# EAGLE design processingController (EAGLE 6.4)
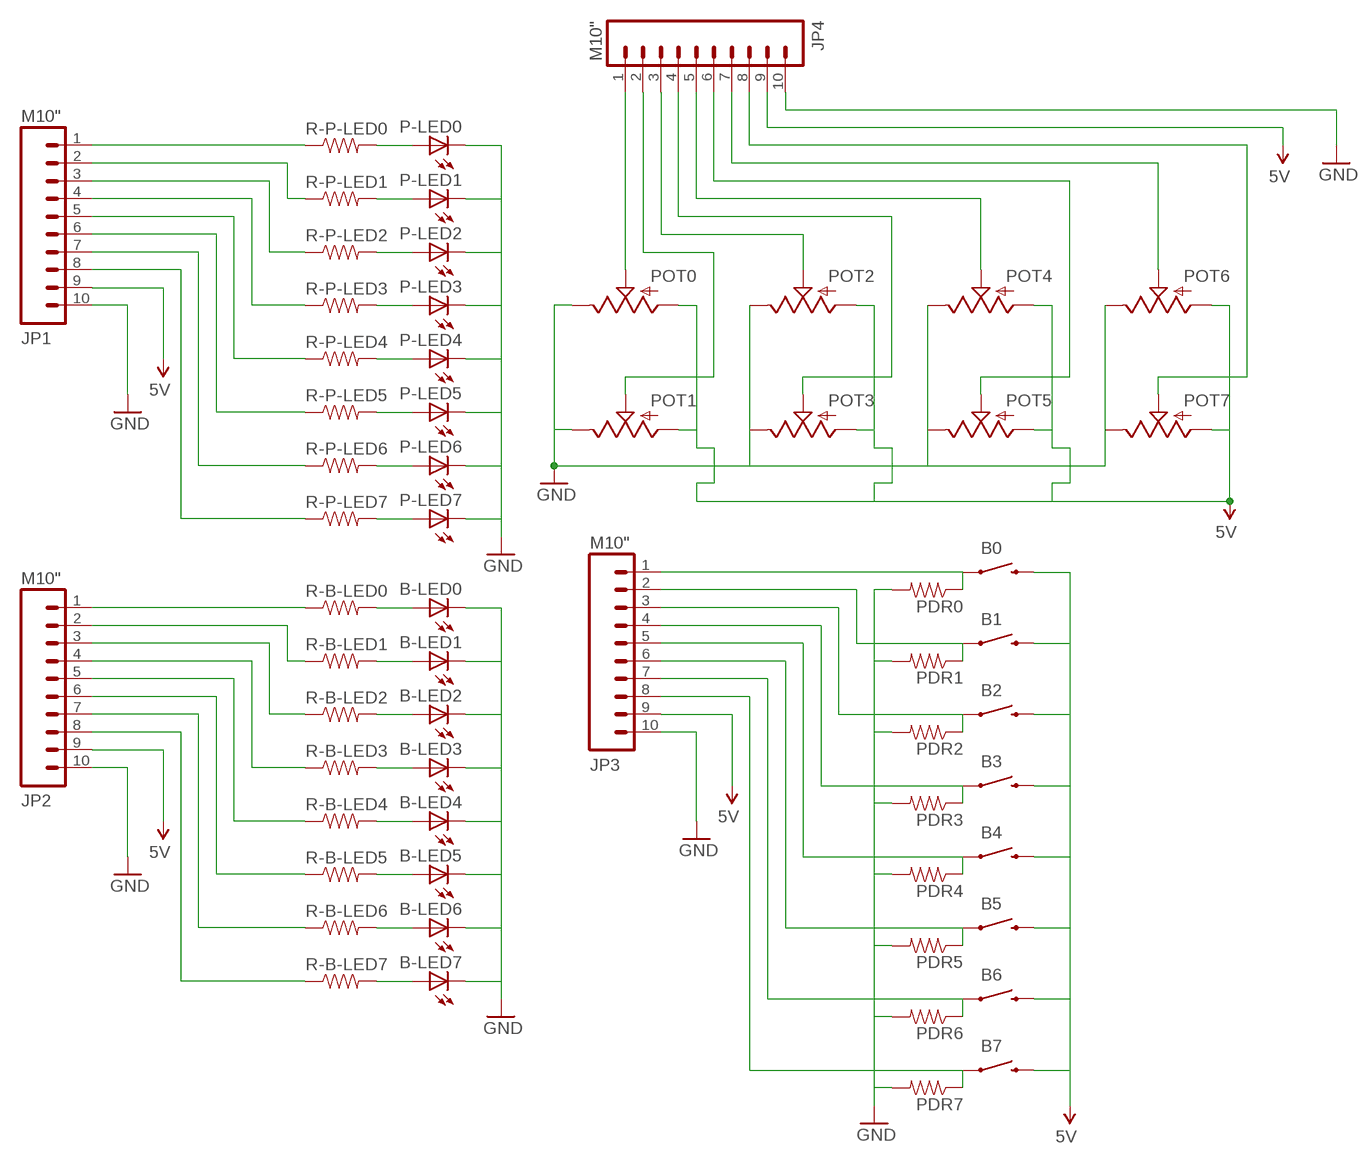
[diagram p0: schematic, sheet 1]

## Parts
B0  SWITCH-MOMENTARY-212MM  [TACTILE-PTH-12MM]
B1  SWITCH-MOMENTARY-212MM  [TACTILE-PTH-12MM]
B2  SWITCH-MOMENTARY-212MM  [TACTILE-PTH-12MM]
B3  SWITCH-MOMENTARY-212MM  [TACTILE-PTH-12MM]
B4  SWITCH-MOMENTARY-212MM  [TACTILE-PTH-12MM]
B5  SWITCH-MOMENTARY-212MM  [TACTILE-PTH-12MM]
B6  SWITCH-MOMENTARY-212MM  [TACTILE-PTH-12MM]
B7  SWITCH-MOMENTARY-212MM  [TACTILE-PTH-12MM]
B-LED0  LED3MM  [LED3MM]
B-LED1  LED3MM  [LED3MM]
B-LED2  LED3MM  [LED3MM]
B-LED3  LED3MM  [LED3MM]
B-LED4  LED3MM  [LED3MM]
B-LED5  LED3MM  [LED3MM]
B-LED6  LED3MM  [LED3MM]
B-LED7  LED3MM  [LED3MM]
JP1  M10"  [1X10]
JP2  M10"  [1X10]
JP3  M10"  [1X10]
JP4  M10"  [1X10]
P-LED0  LED3MM  [LED3MM]
P-LED1  LED3MM  [LED3MM]
P-LED2  LED3MM  [LED3MM]
P-LED3  LED3MM  [LED3MM]
P-LED4  LED3MM  [LED3MM]
P-LED5  LED3MM  [LED3MM]
P-LED6  LED3MM  [LED3MM]
P-LED7  LED3MM  [LED3MM]
PDR0  RESISTOREZ  [AXIAL-0.3EZ]
PDR1  RESISTOREZ  [AXIAL-0.3EZ]
PDR2  RESISTOREZ  [AXIAL-0.3EZ]
PDR3  RESISTOREZ  [AXIAL-0.3EZ]
PDR4  RESISTOREZ  [AXIAL-0.3EZ]
PDR5  RESISTOREZ  [AXIAL-0.3EZ]
PDR6  RESISTOREZ  [AXIAL-0.3EZ]
PDR7  RESISTOREZ  [AXIAL-0.3EZ]
POT0  POT  [ALPS_POT]
POT1  POT  [ALPS_POT]
POT2  POT  [ALPS_POT]
POT3  POT  [ALPS_POT]
POT4  POT  [ALPS_POT]
POT5  POT  [ALPS_POT]
POT6  POT  [ALPS_POT]
POT7  POT  [ALPS_POT]
R-B-LED0  RESISTOREZ  [AXIAL-0.3EZ]
R-B-LED1  RESISTOREZ  [AXIAL-0.3EZ]
R-B-LED2  RESISTOREZ  [AXIAL-0.3EZ]
R-B-LED3  RESISTOREZ  [AXIAL-0.3EZ]
R-B-LED4  RESISTOREZ  [AXIAL-0.3EZ]
R-B-LED5  RESISTOREZ  [AXIAL-0.3EZ]
R-B-LED6  RESISTOREZ  [AXIAL-0.3EZ]
R-B-LED7  RESISTOREZ  [AXIAL-0.3EZ]
R-P-LED0  RESISTOREZ  [AXIAL-0.3EZ]
R-P-LED1  RESISTOREZ  [AXIAL-0.3EZ]
R-P-LED2  RESISTOREZ  [AXIAL-0.3EZ]
R-P-LED3  RESISTOREZ  [AXIAL-0.3EZ]
R-P-LED4  RESISTOREZ  [AXIAL-0.3EZ]
R-P-LED5  RESISTOREZ  [AXIAL-0.3EZ]
R-P-LED6  RESISTOREZ  [AXIAL-0.3EZ]
R-P-LED7  RESISTOREZ  [AXIAL-0.3EZ]

## Nets
5V: B0.3 B1.3 B2.3 B3.3 B4.3 B5.3 B6.3 B7.3 JP1.9 JP2.9 JP3.9 JP4.9 POT0.P$3(A) POT1.P$3(A) POT2.P$3(A) POT3.P$3(A) POT4.P$3(A) POT5.P$3(A) POT6.P$3(A) POT7.P$3(A)
GND: B-LED0.K(C) B-LED1.K(C) B-LED2.K(C) B-LED3.K(C) B-LED4.K(C) B-LED5.K(C) B-LED6.K(C) B-LED7.K(C) JP1.10 JP2.10 JP3.10 JP4.10 P-LED0.K(C) P-LED1.K(C) P-LED2.K(C) P-LED3.K(C) P-LED4.K(C) P-LED5.K(C) P-LED6.K(C) P-LED7.K(C) PDR0.P$2 PDR1.P$2 PDR2.P$2 PDR3.P$2 PDR4.P$2 PDR5.P$2 PDR6.P$2 PDR7.P$2 POT0.P$1(E) POT1.P$1(E) POT2.P$1(E) POT3.P$1(E) POT4.P$1(E) POT5.P$1(E) POT6.P$1(E) POT7.P$1(E)
N$1: P-LED0.A R-P-LED0.P$2
N$2: P-LED1.A R-P-LED1.P$2
N$3: P-LED2.A R-P-LED2.P$2
N$4: P-LED3.A R-P-LED3.P$2
N$5: P-LED4.A R-P-LED4.P$2
N$6: P-LED5.A R-P-LED5.P$2
N$7: P-LED6.A R-P-LED6.P$2
N$8: P-LED7.A R-P-LED7.P$2
N$9: B-LED1.A R-B-LED1.P$2
N$10: B-LED2.A R-B-LED2.P$2
N$11: B-LED3.A R-B-LED3.P$2
N$12: B-LED4.A R-B-LED4.P$2
N$13: B-LED5.A R-B-LED5.P$2
N$14: B-LED6.A R-B-LED6.P$2
N$15: B-LED7.A R-B-LED7.P$2
N$16: B-LED0.A R-B-LED0.P$2
N$17: JP1.1 R-P-LED0.P$1
N$18: JP1.2 R-P-LED1.P$1
N$19: JP1.3 R-P-LED2.P$1
N$20: JP1.4 R-P-LED3.P$1
N$21: JP1.5 R-P-LED4.P$1
N$22: JP1.6 R-P-LED5.P$1
N$23: JP1.7 R-P-LED6.P$1
N$24: JP1.8 R-P-LED7.P$1
N$25: JP4.1 POT0.P$2(S)
N$26: JP2.1 R-B-LED0.P$1
N$27: JP2.2 R-B-LED1.P$1
N$28: JP2.3 R-B-LED2.P$1
N$29: JP2.4 R-B-LED3.P$1
N$30: JP2.5 R-B-LED4.P$1
N$31: JP2.6 R-B-LED5.P$1
N$32: JP2.7 R-B-LED6.P$1
N$33: JP2.8 R-B-LED7.P$1
N$34: JP4.3 POT2.P$2(S)
N$35: JP4.5 POT4.P$2(S)
N$36: JP4.7 POT6.P$2(S)
N$42: JP4.2 POT1.P$2(S)
N$44: JP4.4 POT3.P$2(S)
N$45: JP4.6 POT5.P$2(S)
N$46: JP4.8 POT7.P$2(S)
PDR0: B0.1 JP3.1 PDR0.P$1
PDR1: B1.1 JP3.2 PDR1.P$1
PDR2: B2.1 JP3.3 PDR2.P$1
PDR3: B3.1 JP3.4 PDR3.P$1
PDR4: B4.1 JP3.5 PDR4.P$1
PDR5: B5.1 JP3.6 PDR5.P$1
PDR6: B6.1 JP3.7 PDR6.P$1
PDR7: B7.1 JP3.8 PDR7.P$1

## Library data of the parts
B0 B1-B7 = SparkFun-Electromechanical:SWITCH-MOMENTARY-2: Various NO switches- pushbuttons, reed, etc
B-LED0 B-LED1-B-LED7 P-LED0 P-LED1-P-LED7 = SparkFun-LED:LED: LEDs Standard schematic elements and footprints for 5mm, 3mm, 1206, and 0603 sized LEDs. 5mm - Spark Fun Electronics SKU : COM-00529 (and others)
JP1-JP4 = SparkFun-Connectors:M10: Header 10 Standard 10-pin 0.1" header. Use with straight break away headers (SKU : PRT-00116), right angle break away headers (PRT-00553), swiss pins (PRT-00743), machine pins (PRT-00117), and female headers (PRT-00115).
PDR0 PDR1-PDR7 R-B-LED0 R-B-LED1-R-B-LED7 R-P-LED0 R-P-LED1-R-P-LED7 = SparkFun-Passives:RESISTOR: Resistor Basic schematic elements and footprints for 0603, 1206, and PTH resistors.
POT0 POT1-POT7 = SparkFun-Electromechanical:POT

## Board
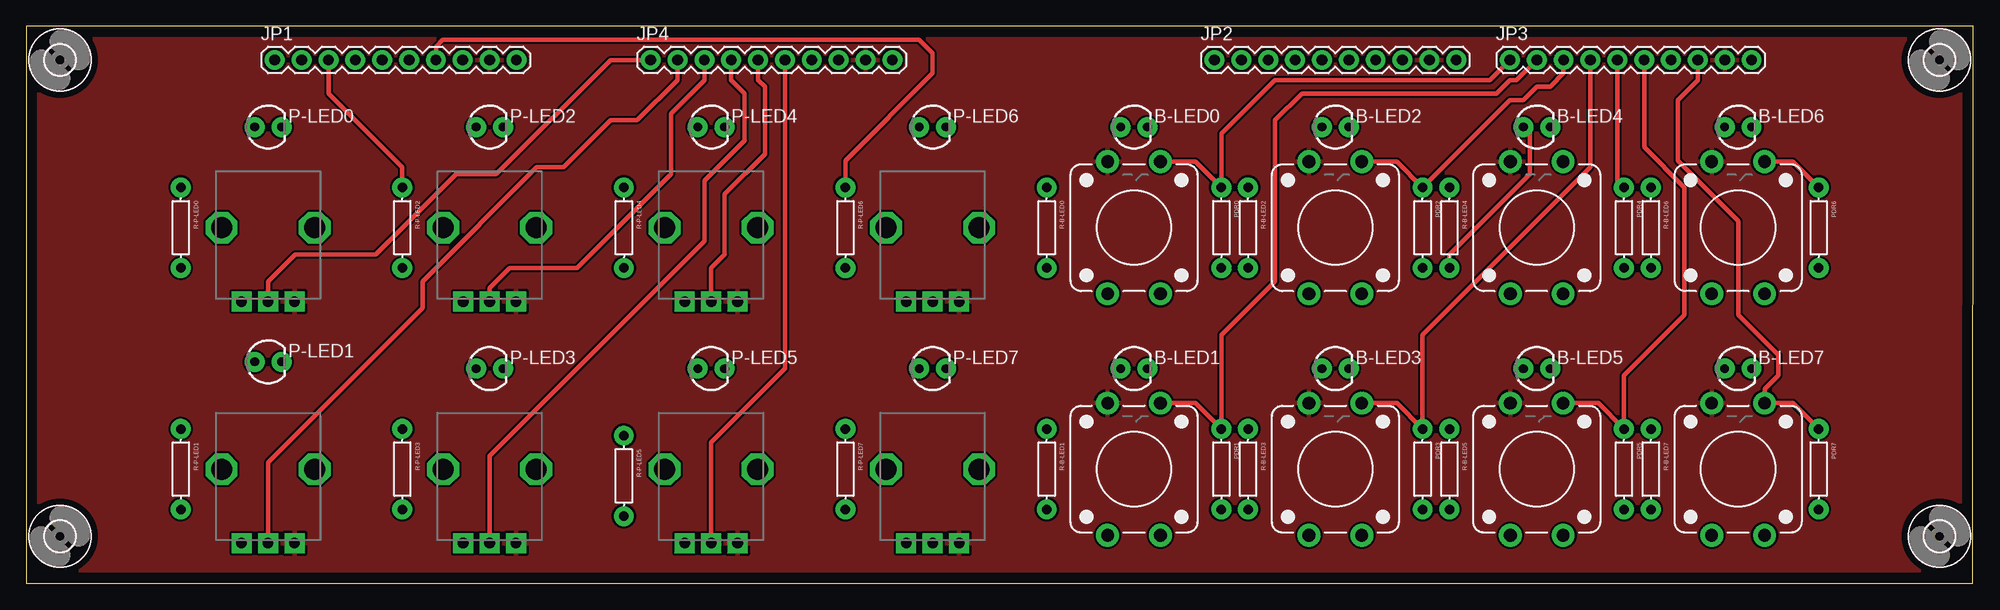
[diagram p1: board, top side]
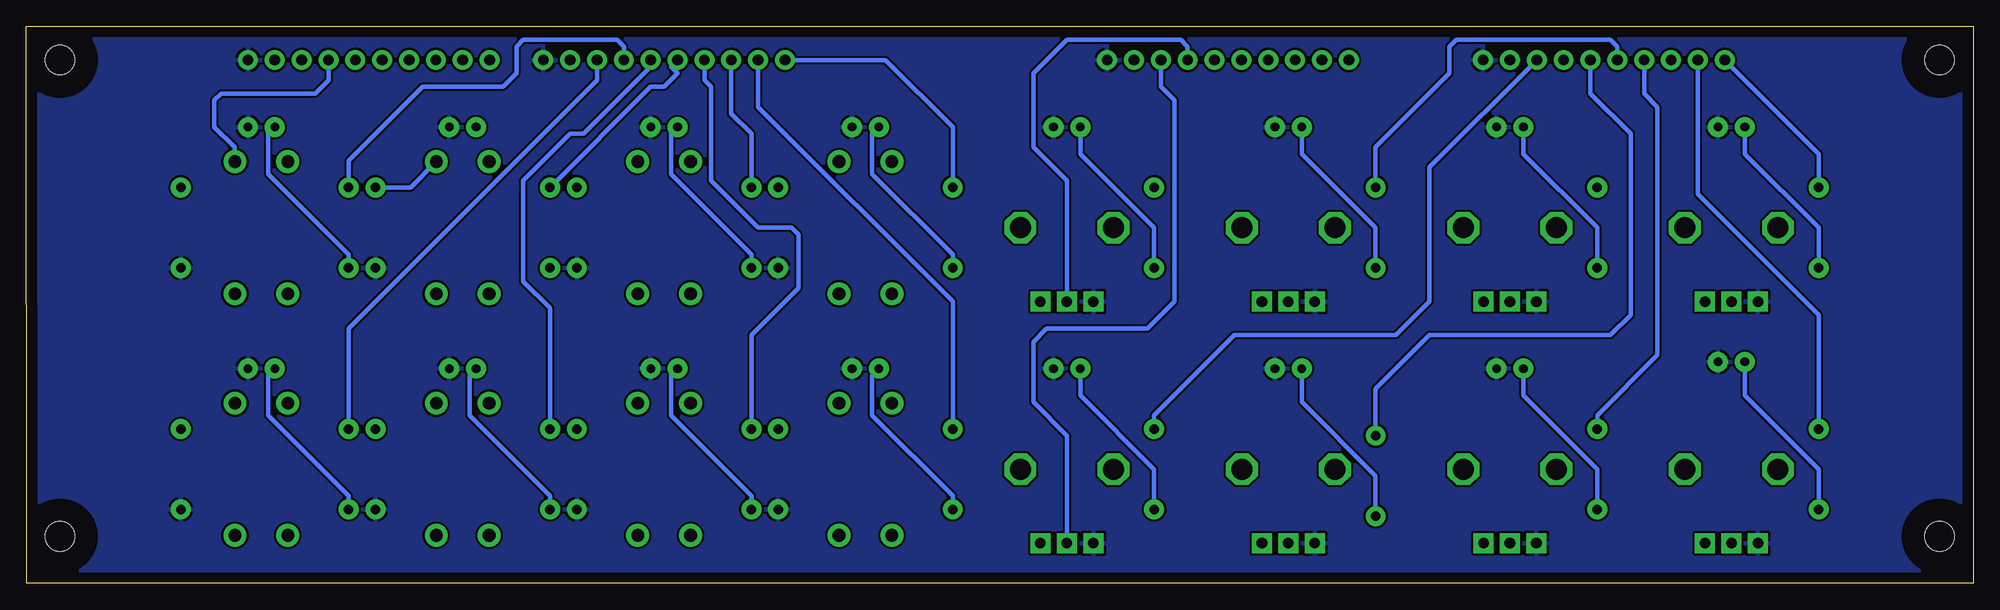
[diagram p2: board, bottom side, seen from below]

Size 184.15 x 52.7 mm. Coordinates in mm from the lower left corner, seen from the top.
Outline: 0,0 184.13,0 184.15,52.7 0,52.7 0,0
Copper layers (1*16): Top 0.035mm / dielectric 1.5mm / Bottom 0.035mm
Design rules "default": minimum track width 10mil, minimum drill 24mil, track to track 8mil, track to pad 8mil, pad to pad 8mil, via to via 8mil, smd to smd 8mil, copper to edge 40mil, drill to drill 8mil, minimum pad ring 10mil, minimum via ring 8mil, stop-mask expansion 4mil, vias tented up to drill 0mil, thermal gap 10mil

### Footprints (pad centres in the part's own frame; a part is rotated, then mirrored left to right if it is on the bottom)
TACTILE-PTH-12MM = drill 1.2 pad 2.159: 1 6.25,-2.5; 2 -6.25,-2.5; 3 6.25,2.5; 4 -6.25,2.5
LED3MM = drill 0.813 pad 1.88: A -1.27,0; K 1.27,0
1X10 = drill 1.016 pad 1.88: 1 0,0; 2 2.54,0; 3 5.08,0; 4 7.62,0; 5 10.16,0; 6 12.7,0; 7 15.24,0; 8 17.78,0; 9 20.32,0; 10 22.86,0
AXIAL-0.3EZ = drill 0.9 pad 1.88: P$1 -3.81,0; P$2 3.81,0
ALPS_POT = drill 1 pad 1.88 square: P$1 7,-2.5; P$2 7,0; P$3 7,2.5 | drill 2 octagon: P$4 0,-4.4; P$5 0,4.4
2,8 = hole 2.8: 0,0

### Placement (x,y rotation side)
B0  104.78,33.66 90 top
B1  104.78,10.79 90 top
B2  123.83,33.66 90 top
B3  123.83,10.79 90 top
B4  142.88,33.66 90 top
B5  142.88,10.79 90 top
B6  161.93,33.66 90 top
B7  161.93,10.79 90 top
B-LED0  104.78,43.18 0 top
B-LED1  104.78,20.32 0 top
B-LED2  123.83,43.18 0 top
B-LED3  123.83,20.32 0 top
B-LED4  142.88,43.18 0 top
B-LED5  142.88,20.32 0 top
B-LED6  161.93,43.18 0 top
B-LED7  161.93,20.32 0 top
JP1  23.5,49.53 0 top
JP2  112.39,49.53 0 top
JP3  140.34,49.53 0 top
JP4  59.05,49.53 0 top
P-LED0  22.86,43.18 0 top
P-LED1  22.86,20.95 0 top
P-LED2  43.81,43.18 0 top
P-LED3  43.81,20.32 0 top
P-LED4  64.77,43.18 0 top
P-LED5  64.77,20.32 0 top
P-LED6  85.72,43.18 0 top
P-LED7  85.72,20.32 0 top
PDR0  113.03,33.66 270 top
PDR1  113.03,10.79 270 top
PDR2  132.08,33.66 270 top
PDR3  132.08,10.79 270 top
PDR4  151.13,33.66 270 top
PDR5  151.13,10.79 270 top
PDR6  169.54,33.66 270 top
PDR7  169.54,10.79 270 top
POT0  22.86,33.66 270 top
POT1  22.86,10.79 270 top
POT2  43.81,33.66 270 top
POT3  43.81,10.79 270 top
POT4  64.77,33.66 270 top
POT5  64.77,10.79 270 top
POT6  85.72,33.66 270 top
POT7  85.72,10.79 270 top
R-B-LED0  96.52,33.66 270 top
R-B-LED1  96.52,10.79 270 top
R-B-LED2  115.57,33.66 270 top
R-B-LED3  115.57,10.79 270 top
R-B-LED4  134.62,33.66 270 top
R-B-LED5  134.62,10.79 270 top
R-B-LED6  153.67,33.66 270 top
R-B-LED7  153.67,10.79 270 top
R-P-LED0  14.61,33.66 270 top
R-P-LED1  14.61,10.79 270 top
R-P-LED2  35.56,33.66 270 top
R-P-LED3  35.56,10.79 270 top
R-P-LED4  56.52,33.66 270 top
R-P-LED5  56.52,10.16 270 top
R-P-LED6  77.47,33.66 270 top
R-P-LED7  77.47,10.79 270 top
U$1  [2,8]  3.17,4.45 0 top
U$2  [2,8]  3.17,49.53 0 top
U$3  [2,8]  180.97,49.53 0 top
U$4  [2,8]  180.97,4.45 0 top

### Tracks (layer width: path | path; a pad name or v marks a point on that pad's centre or on a via)
5V
  pour Top: -2.54,55.24 186.69,55.88 186.69,-2.54 -2.54,-2.54
GND
  pour Bottom: -1.27,53.98 185.42,54.61 185.42,-1.27 -0.64,-1.27
N$1
  Bottom 0.406: R-P-LED0.P$2 14.61,33.66 21.59,40.64 P-LED0.A
N$2
  Bottom 0.406: R-P-LED1.P$2 14.61,10.79 21.59,17.78 P-LED1.A
N$3
  Bottom 0.406: R-P-LED2.P$2 35.56,33.66 42.55,40.64 P-LED2.A
N$4
  Bottom 0.406: R-P-LED3.P$2 35.56,10.79 42.55,17.78 P-LED3.A
N$5
  Bottom 0.406: R-P-LED4.P$2 56.52,33.66 63.5,40.64 P-LED4.A
N$6
  Bottom 0.406: R-P-LED5.P$2 56.52,10.16 63.5,17.14 P-LED5.A
N$7
  Bottom 0.406: R-P-LED6.P$2 77.47,33.66 84.45,40.64 P-LED6.A
N$8
  Bottom 0.406: R-P-LED7.P$2 77.47,10.79 84.45,17.78 P-LED7.A
N$9
  Bottom 0.406: R-B-LED1.P$2 96.52,8.26 104.14,15.88 104.14,19.68 B-LED1.A
N$10
  Bottom 0.406: R-B-LED2.P$2 115.57,31.11 123.19,38.73 123.19,42.55 B-LED2.A
N$11
  Bottom 0.406: R-B-LED3.P$2 115.57,8.26 123.19,15.88 123.19,19.68 B-LED3.A
N$12
  Top 0.406: R-B-LED4.P$2 134.62,31.11 142.24,38.73 142.24,42.55 B-LED4.A
N$13
  Bottom 0.406: R-B-LED5.P$2 134.62,8.26 142.24,15.88 142.24,19.68 B-LED5.A
N$14
  Bottom 0.406: R-B-LED6.P$2 153.67,31.11 161.29,38.73 161.29,42.55 B-LED6.A
N$15
  Bottom 0.406: R-B-LED7.P$2 153.67,8.26 161.29,15.88 161.29,19.68 B-LED7.A
N$16
  Bottom 0.406: R-B-LED0.P$2 96.52,31.11 104.14,38.73 104.14,42.55 B-LED0.A
N$17
  Bottom 0.406: R-P-LED0.P$1 14.61,40.64 JP1.1
N$18
  Bottom 0.406: R-P-LED1.P$1 14.61,25.4 26.04,36.83 JP1.2
N$19
  Top 0.406: R-P-LED2.P$1 35.56,39.37 28.57,46.35 JP1.3
N$20
  Bottom 0.406: R-P-LED3.P$1 35.56,15.88 29.84,21.59 29.84,45.09 31.11,46.35 JP1.4
N$21
  Bottom 0.406: R-P-LED4.P$1 56.52,41.27 49.53,48.26 49.53,50.8 48.9,51.44 34.29,51.44 33.66,50.8 JP1.5
N$22
  Bottom 0.406: R-P-LED5.P$1 56.52,18.41 51.44,23.5 34.29,23.5 32.38,25.4 32.38,42.55 36.2,46.35 JP1.6
N$23
  Top 0.406: R-P-LED6.P$1 77.47,40.01 85.72,48.26 85.72,50.16 84.45,51.44 39.37,51.44 38.73,50.8 JP1.7
N$24
  Bottom 0.406: R-P-LED7.P$1 77.47,15.88 69.85,23.5 54.61,23.5 51.44,26.67 51.44,39.37 JP1.8
N$25
  Top 0.406: POT0.P$2 22.86,28.57 25.4,31.11 33.02,31.11 40.64,38.73 44.45,38.73 55.24,49.53 JP4.1
N$26
  Bottom 0.406: R-B-LED0.P$1 96.52,43.18 102.87,49.53 JP2.1
N$27
  Bottom 0.406: R-B-LED1.P$1 96.52,26.67 114.94,45.09 JP2.2
N$28
  Bottom 0.406: R-B-LED2.P$1 115.57,42.55 117.47,44.45 JP2.3
N$29
  Bottom 0.406: R-B-LED3.P$1 115.57,23.5 111.12,27.94 111.12,33.02 111.76,33.66 114.94,33.66 119.38,38.1 119.38,46.99 120.02,47.62 JP2.4
N$30
  Bottom 0.406: R-B-LED4.P$1 125.09,46.99 123.83,46.99 122.56,48.26 123.19,48.9 JP2.5
N$31
  Bottom 0.406: R-B-LED5.P$1 134.62,26.04 137.16,28.57 137.16,38.1 132.72,42.55 131.44,42.55 125.09,48.9 JP2.6
N$32
  Bottom 0.406: R-B-LED6.P$1 153.67,40.01 146.69,46.99 139.06,46.99 137.79,48.26 137.79,50.8 137.16,51.44 128.27,51.44 127.64,50.8 JP2.7
N$33
  Bottom 0.406: R-B-LED7.P$1 153.67,24.13 130.18,47.62 JP2.8
N$34
  Top 0.406: POT2.P$2 43.81,27.94 45.72,29.84 52.07,29.84 60.96,38.73 60.96,44.45 64.14,47.62 JP4.3
N$35
  Top 0.406: POT4.P$2 64.77,29.84 66.04,31.11 66.04,36.83 69.85,40.64 69.85,46.99 69.22,47.62 JP4.5
N$36
  Bottom 0.406: POT6.P$2 85.72,38.1 88.9,41.27 88.9,48.26 85.72,51.44 74.93,51.44 74.3,50.8 JP4.7
N$42
  Top 0.406: POT1.P$2 22.86,11.43 37.47,26.04 37.47,28.57 48.26,39.37 50.8,39.37 55.24,43.81 57.78,43.81 61.59,47.62 JP4.2
N$44
  Top 0.406: POT3.P$2 43.81,12.06 64.14,32.38 64.14,38.1 67.94,41.91 67.94,46.35 66.67,47.62 JP4.4
N$45
  Top 0.406: POT5.P$2 64.77,13.34 71.75,20.32 JP4.6
N$46
  Bottom 0.406: POT7.P$2 85.72,13.97 88.9,17.14 88.9,22.86 87.63,24.13 78.11,24.13 75.56,26.67 75.56,45.72 76.83,46.99 JP4.8
PDR0
  Top 0.406: B0.1 110.59,39.91 PDR0.P$1 113.03,42.55 118.11,47.62 138.43,47.62 JP3.1
PDR1
  Top 0.406: B1.1 110.59,17.05 PDR1.P$1 113.03,23.5 118.11,28.57 118.11,43.81 120.65,46.35 139.06,46.35 140.34,47.62 140.97,47.62 JP3.2
PDR2
  Top 0.406: B2.1 129.64,39.91 PDR2.P$1 140.34,45.72 141.6,45.72 142.88,46.99 144.15,46.99 145.41,48.26 JP3.3
PDR3
  Top 0.406: B3.1 129.64,17.05 PDR3.P$1 132.08,23.5 147.96,39.37 JP3.4
PDR4
  Top 0.406: JP3.5 150.5,38.1 PDR4.P$1
  Bottom 0.406: PDR4.P$1 147.81,37.47 B4.1
PDR5
  Top 0.406: B5.1 148.69,17.05 PDR5.P$1 151.13,19.68 156.84,25.4 156.84,37.47 153.03,41.27 JP3.6
PDR6  (via drill 0.6)
  Top 0.406: PDR6.P$1 167.1,39.91 B6.1 164.43,39.97 v164.47,40.01
  Bottom 0.406: v164.47,40.01 164.47,41.27 166.37,43.18 166.37,45.72 165.74,46.35 156.84,46.35 155.57,47.62 JP3.7
PDR7
  Top 0.406: PDR7.P$1 167.1,17.05 B7.1 164.43,18.38 165.74,19.68 165.74,21.59 161.93,25.4 161.93,34.29 156.21,40.01 156.21,45.72 158.12,47.62 JP3.8